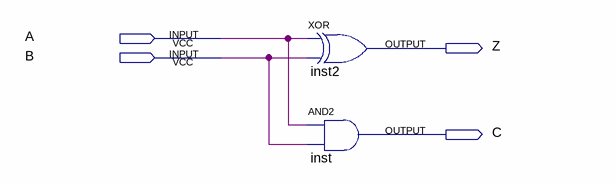
[diagram p0: schematic sheet]
// Quartus schematic ECE_272_Lab_2_Half_Adder.bdf as structural Verilog: 2 symbols, 4 pins
module ECE_272_Lab_2_Half_Adder (
  input  A,
  input  B,
  output Z,
  output C
);

  xor inst2 (Z, A, B);
  and inst (C, A, B);
endmodule
